# Altium project 32M1bREAKOUT.PrjPcb
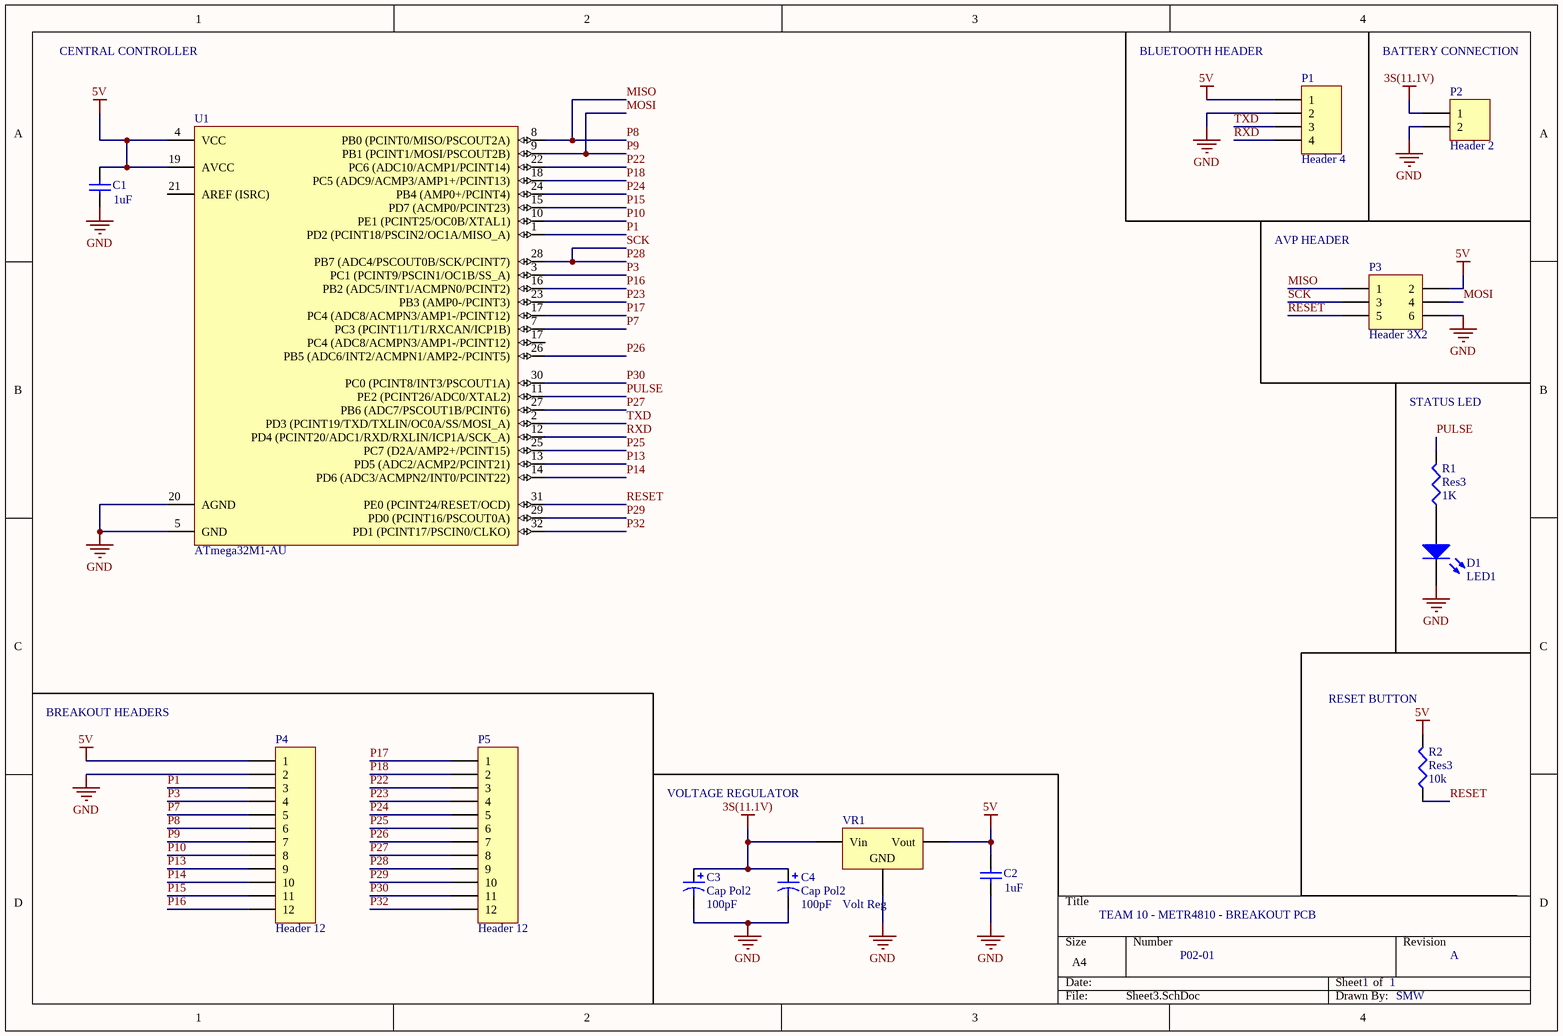
[diagram p0: Sheet3.SchDoc]
1 sheet, 14 parts. Net scope: global (net labels, ports and power ports of the same name join across sheets).
Board file: PCB1.PcbDoc

## Sheet Sheet3.SchDoc
size A4

### Parts
C1  value 1uF  [1608[0603]]  (hidden comment: Cap)
C2  value 1uF  [1608[0603]]  (hidden comment: Cap)
C3  Cap Pol2  value 100pF  [CAPAE9983X105M]
C4  Cap Pol2  value 100pF  [CAPAE9983X105M]
D1  LED1  [L0603]
P1  Header 4  [HDR1X4]
P2  Header 2  [HDR1X2]
P3  Header 3X2  [HDR2X3]
P4  Header 12  [HDR1X12]
P5  Header 12  [HDR1X12]
R1  Res3  value 1K  [J1-0603]
R2  Res3  value 10k  [J1-0603]
U1  ATmega32M1-AU  [32A_L]
VR1  Volt Reg  [D2PAK_N]

### Nets
3S(11.1V): C3.1 C4.1 P2.1 VR1.1(Vin)
5V: C1.2 C2.2 P1.1 P3.2 P4.1 R2.2 U1.4(VCC) U1.19(AVCC) VR1.3(Vout)
GND: C1.1 C2.1 C3.2 C4.2 D1.2(K) P1.2 P2.2 P3.6 P4.2 U1.5(GND) U1.20(AGND) VR1.2(GND)
MISO: P3.1 P4.6 U1.8(PB0_(PCINT0/MISO/PSCOUT2A))  [also labelled P8]
MOSI: P3.4 P4.7 U1.9(PB1_(PCINT1/MOSI/PSCOUT2B))  [also labelled P9]
P1: P4.3 U1.1(PD2_(PCINT18/PSCIN2/OC1A/MISO_A))
P3: P4.4 U1.3(PC1_(PCINT9/PSCIN1/OC1B/SS_A))
P7: P4.5 U1.7(PC3_(PCINT11/T1/RXCAN/ICP1B))
P10: P4.8 U1.10(PE1_(PCINT25/OC0B/XTAL1))
P13: P4.9 U1.13(PD5_(ADC2/ACMP2/PCINT21))
P14: P4.10 U1.14(PD6_(ADC3/ACMPN2/INT0/PCINT22))
P15: P4.11 U1.15(PD7_(ACMP0/PCINT23))
P16: P4.12 U1.16(PB2_(ADC5/INT1/ACMPN0/PCINT2))
P17: P5.1 U1.17(PC4_(ADC8/ACMPN3/AMP1-/PCINT12))
P18: P5.2 U1.18(PC5_(ADC9/ACMP3/AMP1+/PCINT13))
P22: P5.3 U1.22(PC6_(ADC10/ACMP1/PCINT14))
P23: P5.4 U1.23(PB3_(AMP0-/PCINT3))
P24: P5.5 U1.24(PB4_(AMP0+/PCINT4))
P25: P5.6 U1.25(PC7_(D2A/AMP2+/PCINT15))
P26: P5.7 U1.26(PB5_(ADC6/INT2/ACMPN1/AMP2-/PCINT5))
P27: P5.8 U1.27(PB6_(ADC7/PSCOUT1B/PCINT6))
P28: P3.3 P5.9 U1.28(PB7_(ADC4/PSCOUT0B/SCK/PCINT7))  [also labelled SCK]
P29: P5.10 U1.29(PD0_(PCINT16/PSCOUT0A))
P30: P5.11 U1.30(PC0_(PCINT8/INT3/PSCOUT1A))
P32: P5.12 U1.32(PD1_(PCINT17/PSCIN0/CLKO))
PULSE: R1.2 U1.11(PE2_(PCINT26/ADC0/XTAL2))
RESET: P3.5 R2.1 U1.31(PE0_(PCINT24/RESET/OCD))
RXD: P1.4 U1.12(PD4_(PCINT20/ADC1/RXD/RXLIN/ICP1A/SCK_A))
TXD: P1.3 U1.2(PD3_(PCINT19/TXD/TXLIN/OC0A/SS/MOSI_A))
NetD1_1: D1.1(A) R1.1

Not connected (* = marked no-connect by the designer): U1 21(AREF_(ISRC))

### Notes on the sheet
- CENTRAL CONTROLLER
- BLUETOOTH HEADER
- BATTERY CONNECTION
- (near P3) AVP HEADER
- STATUS LED
- BREAKOUT HEADERS
- (near R2) RESET BUTTON
- VOLTAGE REGULATOR
- TEAM 10 - METR4810 - BREAKOUT PCB
- P02-01
- 1
- A
- SMW

### Library data of the parts
C1 C2 = Cap: Capacitor; Published: 8-Jun-2000; LatestRevisionDate: 17-Jul-2002; LatestRevisionNote: Re-released for DXP Platform.; PackageReference: RAD-0.3; Publisher: Altium Limited; PackageDescription: Radial Cap, Thru-Hole; 2 Leads; 0.3 in Pin Spacing
C3 C4 = Cap Pol2: Polarized Capacitor (Axial); Published: 8-Jun-2000; LatestRevisionDate: 17-Jul-2002; LatestRevisionNote: Re-released for DXP Platform.; PackageReference: POLAR0.8; Publisher: Altium Limited; PackageDescription: Polarized Capacitor; 2 Leads
D1 = LED1: Typical RED GaAs LED; Published: 8-Jun-2000; LatestRevisionDate: 08-Jul-2005; LatestRevisionNote: Mech Layer 1 removed.; PackageReference: LED-1; Publisher: Altium Limited; PackageDescription: LED; 2 Leads
P1 = Header 4: Header, 4-Pin; LatestRevisionDate: 17-Jul-2002; LatestRevisionNote: Re-released for DXP Platform.; Publisher: Altium Limited
P2 = Header 2: Header, 2-Pin; LatestRevisionDate: 17-Jul-2002; LatestRevisionNote: Re-released for DXP Platform.; Publisher: Altium Limited
P3 = Header 3X2: Header, 3-Pin, Dual row; LatestRevisionDate: 17-Jul-2002; LatestRevisionNote: Re-released for DXP Platform.; Publisher: Altium Limited
P4 P5 = Header 12: Header, 12-Pin; LatestRevisionDate: 17-Jul-2002; LatestRevisionNote: Re-released for DXP Platform.; Publisher: Altium Limited
R1 R2 = Res3: Resistor; Published: 8-Jun-2000; LatestRevisionDate: 29-May-2009; LatestRevisionNote: IPC-7351 Footprint Added.; PackageReference: J1-0603; Publisher: Altium Limited; PackageDescription: Chip Resistor
U1 = ATmega32M1-AU: 8-bit AVR Microcontroller, 2.7-5.5V, 16MHz, 32KB Flash, 1KB EEPROM, 2KB SRAM, Industrial Grade (-40° to +85°C), 32-Pin TQFP; DatasheetVersion: revD, Nov-2010; PackageVersion: revC, Oct-2010; PackageReference: 32A; PackageDescription: 32-Lead, 7x7x1.0 mm Body, 0.8mm Lead Pitch, Thin Profile Plastic Quad Flat Package (TQFP); Code_JEDEC: MS-026-ABA; ComponentLink1Description: Manufacturer URL; ComponentLink1URL: http://www.atmel.com/; ComponentLink2Description: ATmega16M1/32M1/64M1 Datasheet; ComponentLink2URL: http://www.atmel.com/dyn/resources/prod_documents/doc8209.pdf; ComponentLink3Description: ATmega16M1/32M1/64M1 Summary; ComponentLink3URL: http://www.atmel.com/dyn/resources/prod_documents/8209S.pdf
VR1 = Volt Reg: Voltage Regulator; Published: 24-Mar-1999; LatestRevisionDate: 29-May-2009; LatestRevisionNote: IPC-7351 Footprint Added.; PackageReference: D2PAK; Publisher: Altium Limited; PackageDescription: 3-Pin Transistor Outline Package 2.54 mm Pitch, 15.1 mm Lead Span